# Altium project JEAC605UM-FTTSC-2.0.PRJPCB (part 3 of 3)

## Sheet POWER.schdoc
size D; SheetNumber: 8; SheetTotal: 8
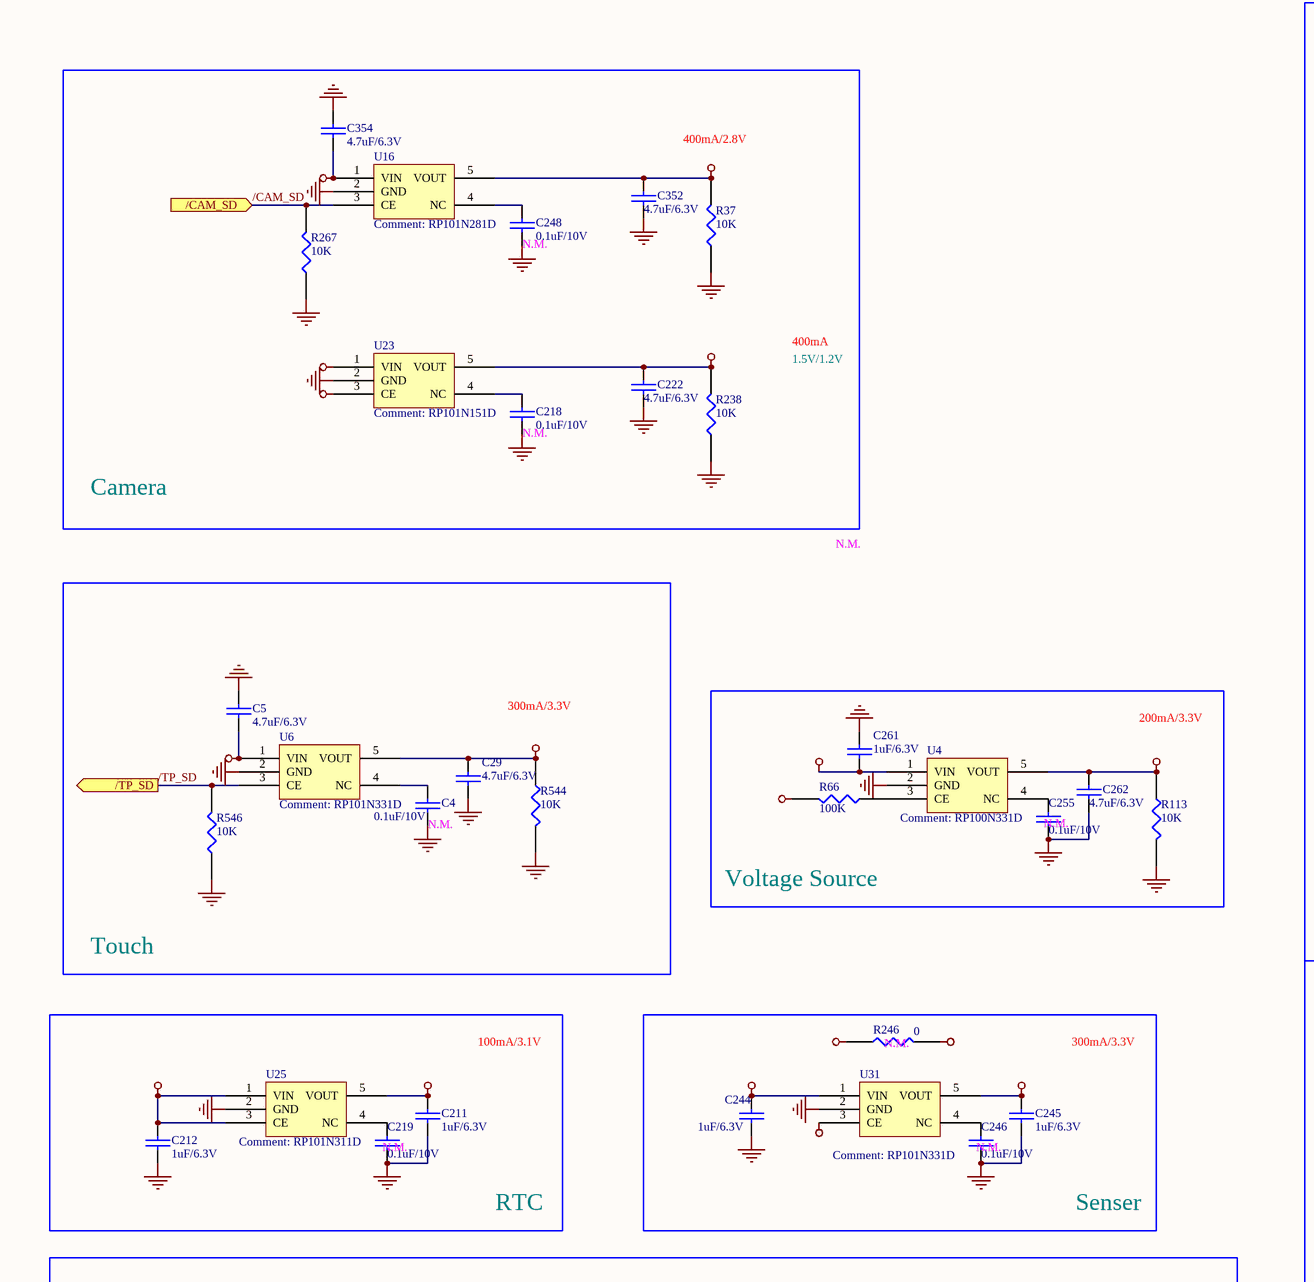
[diagram p13: POWER.schdoc, top left]
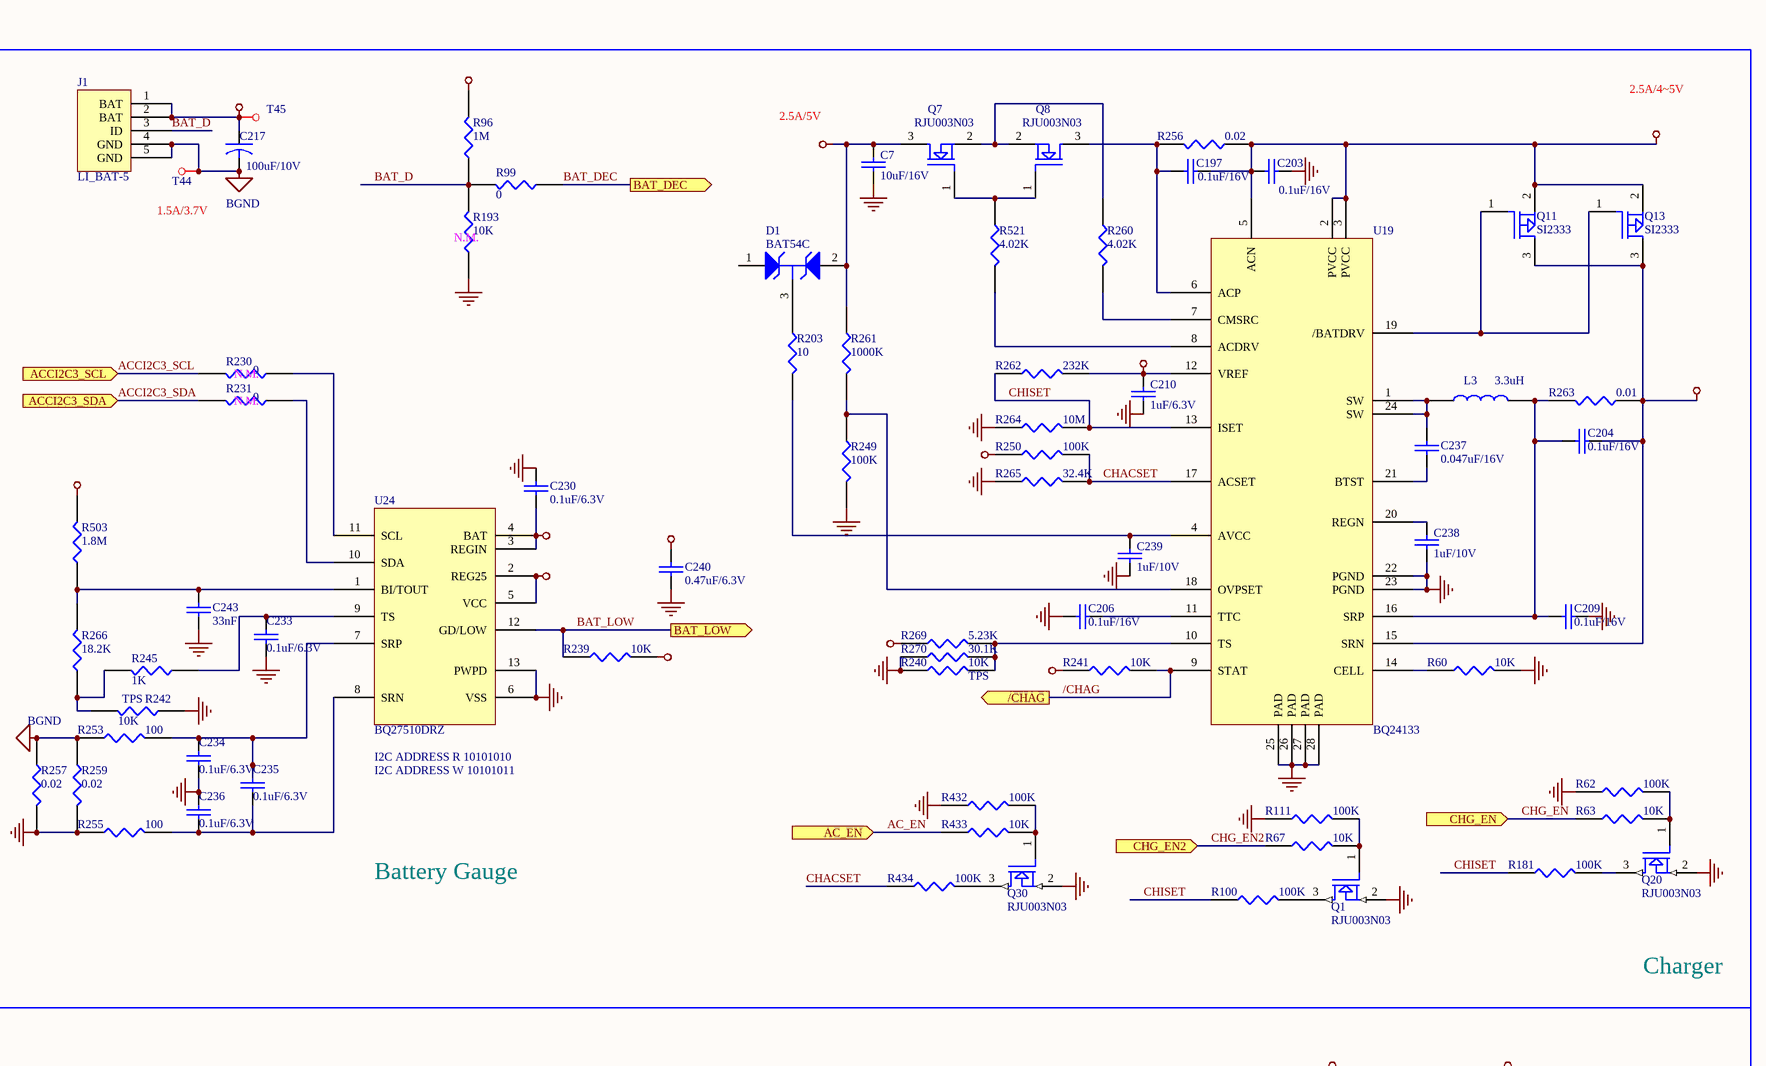
[diagram p14: POWER.schdoc, top middle]
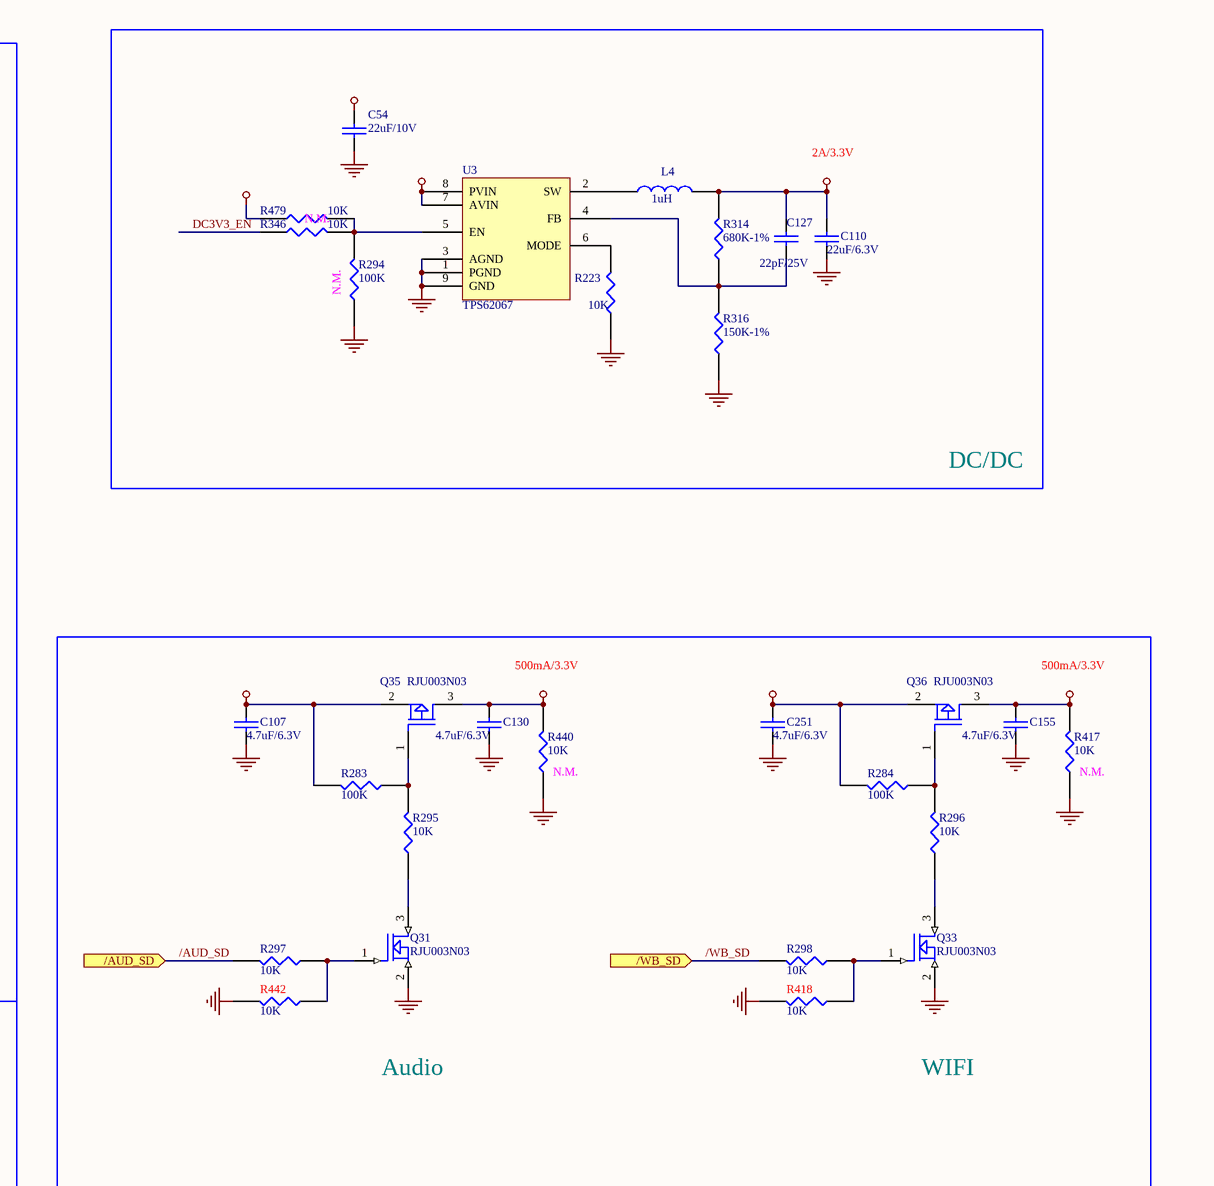
[diagram p15: POWER.schdoc, top right]
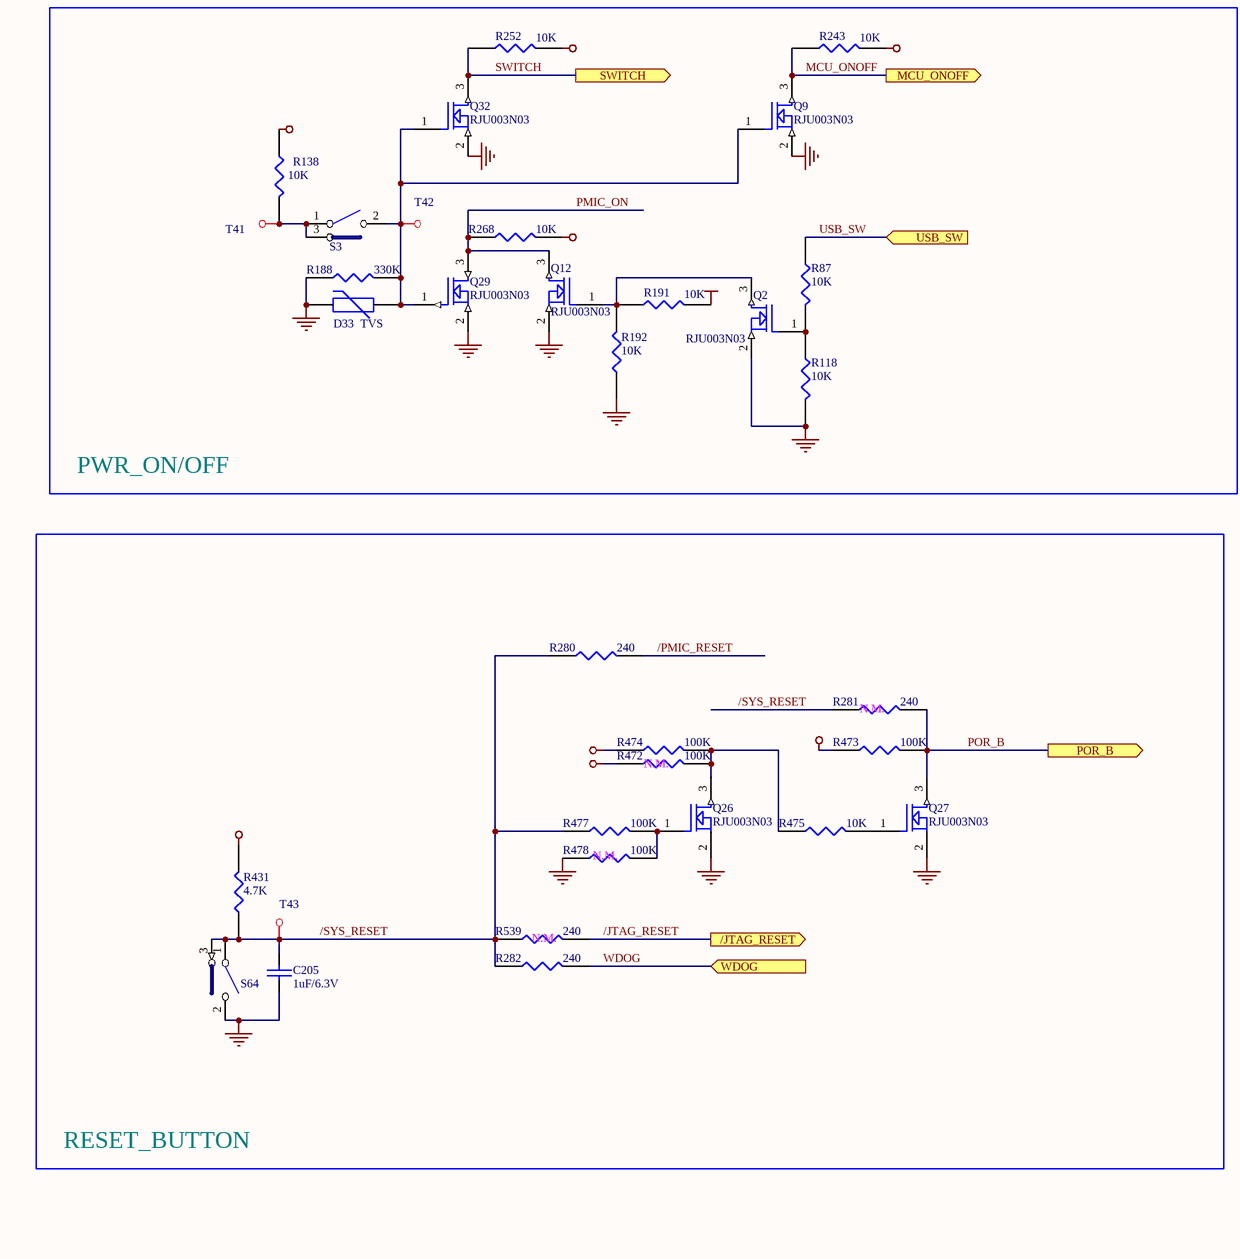
[diagram p16: POWER.schdoc, bottom left]
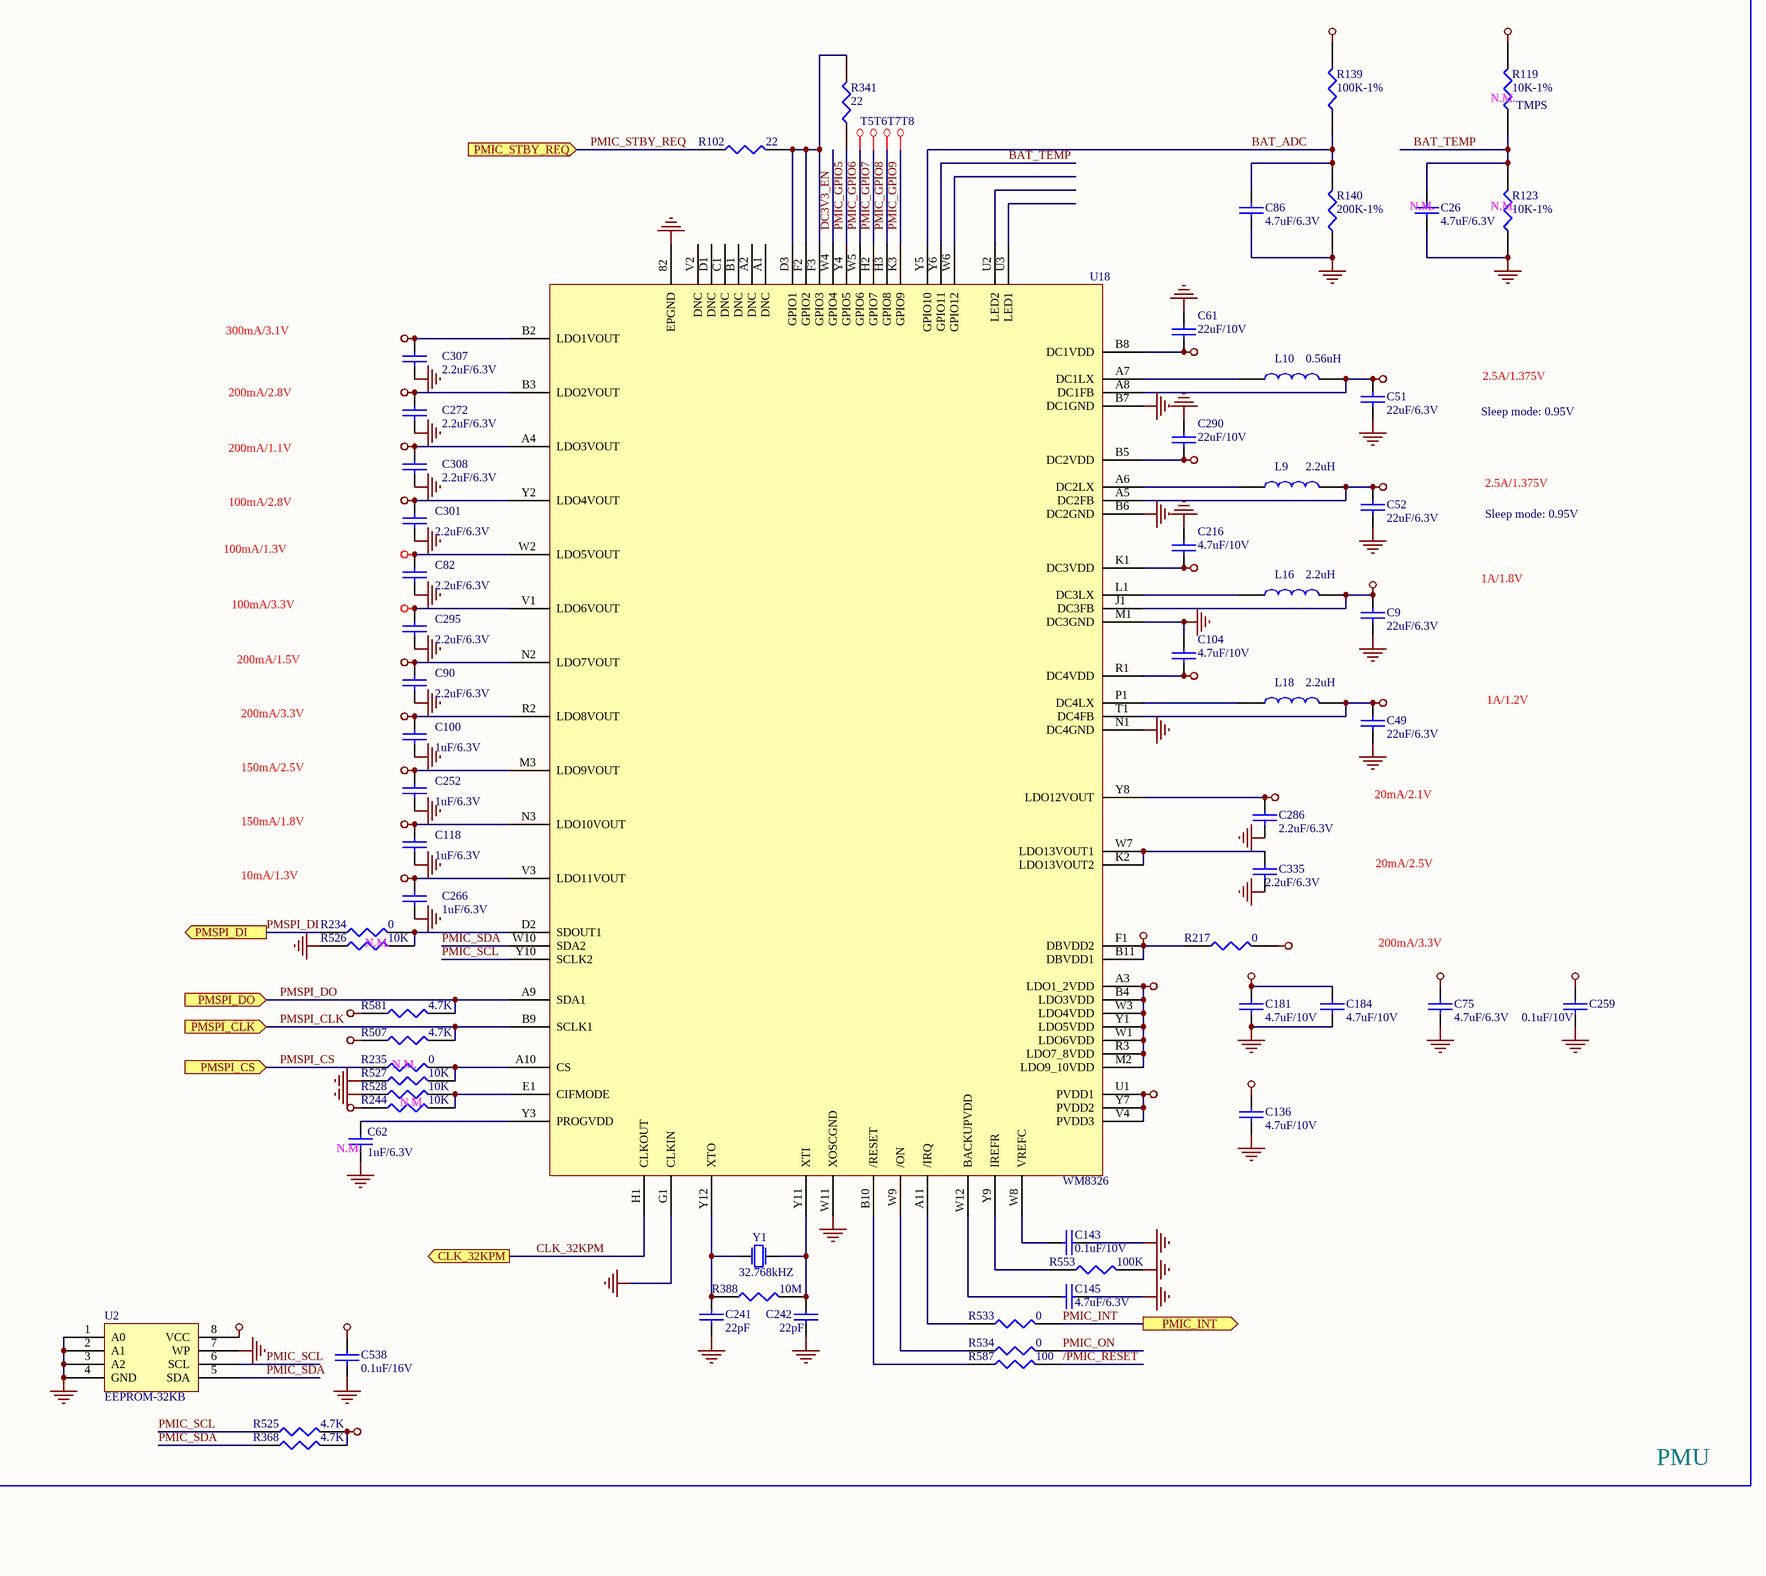
[diagram p17: POWER.schdoc, bottom middle]
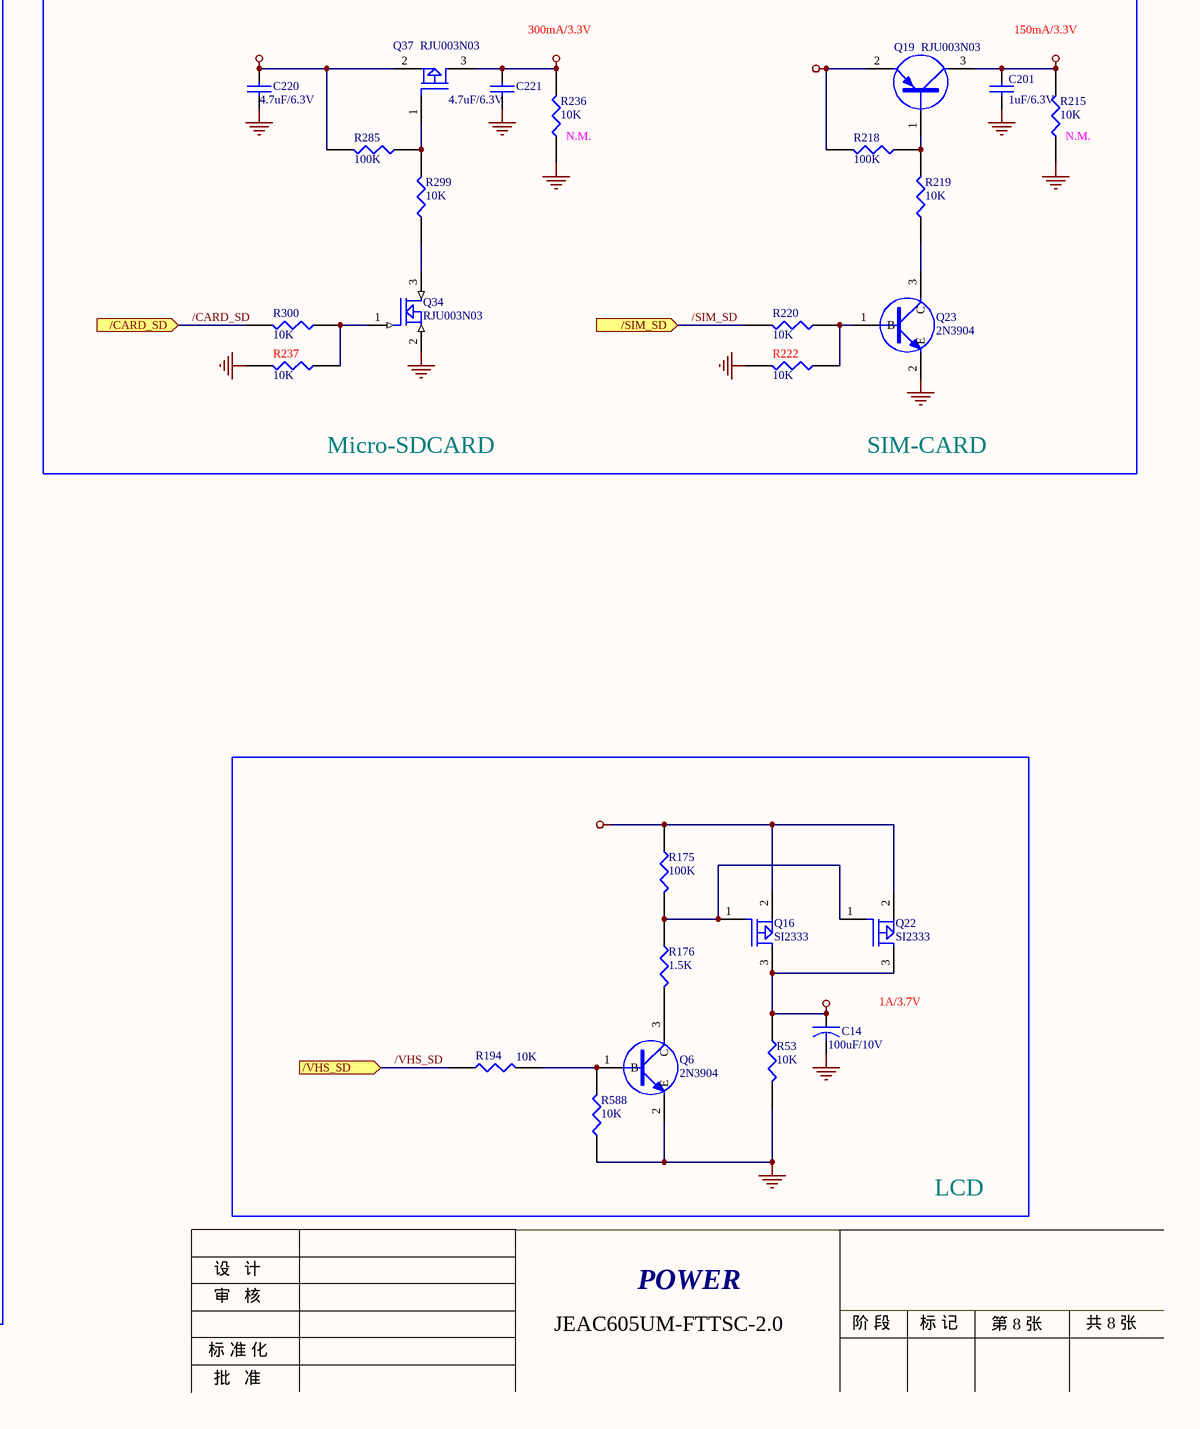
[diagram p18: POWER.schdoc, bottom right]

### Parts
C4  0.1uF/10V  [C0402]
C5  4.7uF/6.3V  [C0603]
C7  10uF/16V  [C1206]
C9  22uF/6.3V  [C0805]
C14  100uF/10V  [CASE-B]
C26  4.7uF/6.3V  [C0603]
C29  4.7uF/6.3V  [C0603]
C49  22uF/6.3V  [C0805]
C51  22uF/6.3V  [C0805]
C52  22uF/6.3V  [C0805]
C54  22uF/10V  [C0805]
C61  22uF/10V  [C0805]
C62  1uF/6.3V  [C0402]
C75  4.7uF/6.3V  [C0603]
C82  2.2uF/6.3V  [C0603]
C86  4.7uF/6.3V  [C0603]
C90  2.2uF/6.3V  [C0603]
C100  1uF/6.3V  [C0402]
C104  4.7uF/10V  [C0603]
C107  4.7uF/6.3V  [C0603]
C110  22uF/6.3V  [C0805]
C118  1uF/6.3V  [C0402]
C127  22pF/25V  [C0402]
C130  4.7uF/6.3V  [C0603]
C136  4.7uF/10V  [C0603]
C143  0.1uF/10V  [C0402]
C145  4.7uF/6.3V  [C0603]
C155  4.7uF/6.3V  [C0603]
C181  4.7uF/10V  [C0603]
C184  4.7uF/10V  [C0603]
C197  0.1uF/16V  [C0402]
C201  1uF/6.3V  [C0402]
C203  0.1uF/16V  [C0402]
C204  0.1uF/16V  [C0402]
C205  1uF/6.3V  [C0603]
C206  0.1uF/16V  [C0402]
C209  0.1uF/16V  [C0402]
C210  1uF/6.3V  [C0402]
C211  1uF/6.3V  [C0402]
C212  1uF/6.3V  [C0402]
C216  4.7uF/10V  [C0603]
C217  100uF/10V  [CASE-B]
C218  0.1uF/10V  [C0402]
C219  0.1uF/10V  [C0402]
C220  4.7uF/6.3V  [C0603]
C221  4.7uF/6.3V  [C0603]
C222  4.7uF/6.3V  [C0603]
C230  0.1uF/6.3V  [C0402]
C233  0.1uF/6.3V  [C0402]
C234  0.1uF/6.3V  [C0402]
C235  0.1uF/6.3V  [C0402]
C236  0.1uF/6.3V  [C0402]
C237  0.047uF/16V  [C0402]
C238  1uF/10V  [C0603]
C239  1uF/10V  [C0603]
C240  0.47uF/6.3V  [C0402]
C241  22pF  [C0402]
C242  22pF  [C0402]
C243  33nF  [C0402]
C244  1uF/6.3V  [C0402]
C245  1uF/6.3V  [C0402]
C246  0.1uF/10V  [C0402]
C248  0.1uF/10V  [C0402]
C251  4.7uF/6.3V  [C0603]
C252  1uF/6.3V  [C0402]
C255  0.1uF/10V  [C0402]
C259  0.1uF/10V  [C0402]
C261  1uF/6.3V  [C0402]
C262  4.7uF/6.3V  [C0603]
C266  1uF/6.3V  [C0402]
C272  2.2uF/6.3V  [C0603]
C286  2.2uF/6.3V  [C0603]
C290  22uF/10V  [C0805]
C295  2.2uF/6.3V  [C0603]
C301  2.2uF/6.3V  [C0603]
C307  2.2uF/6.3V  [C0603]
C308  2.2uF/6.3V  [C0603]
C335  2.2uF/6.3V  [C0603]
C352  4.7uF/6.3V  [C0603]
C354  4.7uF/6.3V  [C0603]
C538  0.1uF/16V  [C0402]
D1  BAT54C  [SOT-23]
D33  TVS  [D06342]
J1  LI_BAT-5  [J-BAT-5-1_25]
L3  3.3uH  [L-2-2_7]
L4  1uH  [l-2-EIA1008]
L9  2.2uH  [l-2-EIA1008]
L10  0.56uH  [l-2-EIA1008]
L16  2.2uH  [l-2-EIA1008]
L18  2.2uH  [l-2-EIA1008]
Q1  RJU003N03  [SOT-23-NPN]
Q2  RJU003N03  [SOT-23-NPN]
Q6  2N3904  [SOT-23-NPN]
Q7  RJU003N03  [SOT-23-NPN]
Q8  RJU003N03  [SOT-23-NPN]
Q9  RJU003N03  [SOT-23-NPN]
Q11  SI2333  [SOT-23]
Q12  RJU003N03  [SOT-23-NPN]
Q13  SI2333  [SOT-23]
Q16  SI2333  [SOT-23]
Q19  RJU003N03  [SOT-23-PNP]
Q20  RJU003N03  [SOT-23-NPN]
Q22  SI2333  [SOT-23]
Q23  2N3904  [SOT-23-NPN]
Q26  RJU003N03  [SOT-23-NPN]
Q27  RJU003N03  [SOT-23-NPN]
Q29  RJU003N03  [SOT-23-NPN]
Q30  RJU003N03  [SOT-23-NPN]
Q31  RJU003N03  [SOT-23-NPN]
Q32  RJU003N03  [SOT-23-NPN]
Q33  RJU003N03  [SOT-23-NPN]
Q34  RJU003N03  [SOT-23-NPN]
Q35  RJU003N03  [SOT-23]
Q36  RJU003N03  [SOT-23]
Q37  RJU003N03  [SOT-23]
R37  10K  [R0402]
R53  10K  [R0402]
R60  10K  [R0402]
R62  100K  [R0402]
R63  10K  [R0402]
R66  100K  [R0402]
R67  10K  [R0402]
R87  10K  [R0402]
R96  1M  [R0402]
R99  0  [R0402]
R100  100K  [R0402]
R102  22  [R0402]
R111  100K  [R0402]
R113  10K  [R0402]
R118  10K  [R0402]
R119  10K-1%  [R0603]
R123  10K-1%  [R0402]
R138  10K  [R0402]
R139  100K-1%  [R0402]
R140  200K-1%  [R0402]
R175  100K  [R0402]
R176  1.5K  [R0402]
R181  100K  [R0402]
R188  330K  [R0402]
R191  10K  [R0402]
R192  10K  [R0402]
R193  10K  [R0402]
R194  10K  [R0402]
R203  10  [R0402]
R215  10K  [R0402]
R217  0  [R0402]
R218  100K  [R0402]
R219  10K  [R0402]
R220  10K  [R0402]
R222  10K  [R0402]
R223  10K  [R0402]
R230  0  [R0402]
R231  0  [R0402]
R234  0  [R0402]
R235  0  [R0402]
R236  10K  [R0402]
R237  10K  [R0402]
R238  10K  [R0402]
R239  10K  [R0603]
R240  10K  [R0603]
R241  10K  [R0603]
R242  10K  [R0603]
R243  10K  [R0402]
R244  10K  [R0402]
R245  1K  [R0402]
R246  0  [R0402]
R249  100K  [R0402]
R250  100K  [R0402]
R252  10K  [R0402]
R253  100  [R0603]
R255  100  [R0603]
R256  0.02  [R0805]
R257  0.02  [R0603]
R259  0.02  [R0603]
R260  4.02K  [R0402]
R261  1000K  [R0402]
R262  232K  [R0402]
R263  0.01  [R0805]
R264  10M  [R0402]
R265  32.4K  [R0402]
R266  18.2K  [R0402]
R267  10K  [R0402]
R268  10K  [R0402]
R269  5.23K  [R0402]
R270  30.1K  [R0402]
R280  240  [R0402]
R281  240  [R0402]
R282  240  [R0402]
R283  100K  [R0402]
R284  100K  [R0402]
R285  100K  [R0402]
R294  100K  [R0402]
R295  10K  [R0402]
R296  10K  [R0402]
R297  10K  [R0402]
R298  10K  [R0402]
R299  10K  [R0402]
R300  10K  [R0402]
R314  680K-1%  [R0402]
R316  150K-1%  [R0402]
R341  22  [R0402]
R346  10K  [R0402]
R368  4.7K  [R0402]
R388  10M  [R0402]
R417  10K  [R0402]
R418  10K  [R0402]
R431  4.7K  [R0402]
R432  100K  [R0402]
R433  10K  [R0402]
R434  100K  [R0402]
R440  10K  [R0402]
R442  10K  [R0402]
R472  100K  [R0402]
R473  100K  [R0402]
R474  100K  [R0402]
R475  10K  [R0402]
R477  100K  [R0402]
R478  100K  [R0402]
R479  10K  [R0402]
R503  1.8M  [R0402]
R507  4.7K  [R0402]
R521  4.02K  [R0402]
R525  4.7K  [R0402]
R526  10K  [R0402]
R527  10K  [R0402]
R528  10K  [R0402]
R533  0  [R0402]
R534  0  [R0402]
R539  240  [R0402]
R544  10K  [R0402]
R546  10K  [R0402]
R553  100K  [R0402]
R581  4.7K  [R0402]
R587  100  [R0402]
R588  10K  [R0402]
S3  SW SPST_side  [J-SW-3-1_225]  (value not drawn)
S64  SW SPST_side  [J-SW-3-1_225]  (value not drawn)
T5  Testpoint  [TP0_5]  (value not drawn)
T6  Testpoint  [TP0_5]  (value not drawn)
T7  Testpoint  [TP0_5]  (value not drawn)
T8  Testpoint  [TP0_5]  (value not drawn)
T41  Testpoint  [TP2_0]  (value not drawn)
T42  Testpoint  [TP2_0]  (value not drawn)
T43  Testpoint  [TP2_0]  (value not drawn)
T44  Testpoint  [TP2_0]  (value not drawn)
T45  Testpoint  [TP2_0]  (value not drawn)
U2  EEPROM-32KB  [U-SO-8-1_27]
U3  TPS62067  [U-QFN-8-0_5]
U4  RP100N331D  [SOT23-5-0_95]
U6  RP101N331D  [SOT23-5-0_95]
U16  RP101N281D  [SOT23-5-0_95]
U18  WM8326  [U-WM-81-8325]
U19  BQ24133  [U-DQFN-24-0_5]
U23  RP101N151D  [SOT23-5-0_95]
U24  BQ27510DRZ  [U-SON-12-0_4]
U25  RP101N311D  [SOT23-5-0_95]
U31  RP101N331D  [SOT23-5-0_95]
Y1  32.768kHZ  [Y-2-XTALB]

### Blocks framed on the sheet
DC/DC: C54 C110 C127 L4 R223 R294 R314 R316 R346 R479 U3
Camera: C218 C222 C248 C352 C354 R37 R238 R267 U16 U23
Touch: C4 C5 C29 R544 R546 U6
Voltage Source: C255 C261 C262 R66 R113 U4
RTC: C211 C212 C219 U25
Senser: C244-C246 R246 U31
PWR_ON/OFF: D33 Q2 Q9 Q12 Q29 Q32 R87 R118 R138 R188 R191 R192 R243 R252 R268 S3 T41 T42
RESET_BUTTON: C205 Q26 Q27 R280-R282 R431 R472-R475 R477 R478 R539 S64 T43
LCD: C14 Q6 Q16 Q22 R53 R175 R176 R194 R588

### Ports
/AUD_SD (in), /CAM_SD (in), /CARD_SD (in), /CHAG (out), /JTAG_RESET (out), /SIM_SD (in), /TP_SD (out), /VHS_SD (in), /WB_SD (in), AC_EN (in), ACCI2C3_SCL (in), ACCI2C3_SDA (in), BAT_DEC (out), BAT_LOW (out), CHG_EN2 (in), CHG_EN (in), CLK_32KPM (out), MCU_ONOFF (out), PMIC_INT (out), PMIC_STBY_REQ (in), PMSPI_CLK (in), PMSPI_CS (in), PMSPI_DI (out), PMSPI_DO (in), POR_B (out), SWITCH (out), USB_SW (in), WDOG (in)

### Nets
BGND: C217.2 J1.4(GND) J1.5(GND) R253.1 R257.1 R259.1 T44.1(TP)
CHVREF: C210.1 R250.1 R262.2 R269.1 U19.12(VREF)
GND: C4.2 C5.2 C7.2 C9.2 C14.2 C26.1 C29.2 C49.2 C51.2 C52.2 C54.2 C61.1 C62.2 C75.2 C82.2 C86.1 C90.2 C100.2 C104.1 C107.2 C110.2 C118.2 C130.1 C136.2 C143.2 C145.2 C155.1 C181.2 C184.2 C201.2 C203.2 C205.1 C206.1 C209.2 C210.2 C211.2 C212.2 C216.1 C218.2 C219.2 C220.2 C221.1 C222.1 C230.2 C233.2 C234.2 C236.1 C238.2 C239.2 C240.2 C241.1 C242.1 C243.2 C244.2 C245.2 C246.2 C248.2 C251.2 C252.2 C255.2 C259.2 C261.2 C262.2 C266.2 C272.2 C286.2 C290.1 C295.2 C301.2 C307.2 C308.2 C335.1 C352.1 C354.2 C538.1 D33.2 J1.6(GND) J1.7(GND) Q1.2(S) Q2.2(S) Q6.2(E) Q9.2(S) Q12.2(S) Q20.2(S) Q23.2(E) Q26.2(S) Q27.2(S) Q29.2(S) Q30.2(S) Q31.2(S) Q32.2(S) Q33.2(S) Q34.2(S) R37.1 R53.2 R60.2 R62.1 R111.1 R113.2 R118.2 R123.1 R140.1 R188.1 R192.1 R193.1 R215.1 R222.2 R223.1 R236.1 R237.2 R238.1 R240.1 R242.1 R249.2 R255.1 R257.2 R259.2 R264.1 R265.1 R267.1 R270.1 R294.1 R316.1 R417.1 R418.2 R432.1 R440.1 R442.2 R478.1 R526.1 R527.1 R528.1 R544.2 R546.1 R553.2 R588.1 S3.6(GND) S3.7(GND) S64.2(NO) S64.6(GND) S64.7(GND) U2.1(A0) U2.2(A1) U2.3(A2) U2.4(GND) U2.7(WP) U3.1(PGND) U3.3(AGND) U3.9(GND) U4.2(GND) U6.2(GND) U16.2(GND) U18.82(EPGND) U18.B6(DC2GND) U18.B7(DC1GND) U18.G1(CLKIN) U18.M1(DC3GND) U18.N1(DC4GND) U18.W11(XOSCGND) U19.22(PGND) U19.23(PGND) U19.25(PAD) U19.26(PAD) U19.27(PAD) U19.28(PAD) U23.2(GND) U24.6(VSS) U24.13(PWPD) U25.2(GND) U31.2(GND)
LDO_1V3: C82.1 U18.W2(LDO5VOUT)
LDO_1V8: C118.1 U18.N3(LDO10VOUT)
LDO_2V5: C252.1 U18.M3(LDO9VOUT)
LDO_3V3: C295.1 U18.V1(LDO6VOUT)
LDO_RTC: C266.1 U18.V3(LDO11VOUT)
USB_BUSIN: R191.2
V_HS: C14.1 Q16.3(D) Q22.3(D) R53.1
VBUS: C7.1 D1.2(K) Q7.3(D) R261.1
VCC_1V1: C308.1 U18.A4(LDO3VOUT)
VCC_1V5: C90.1 U18.N2(LDO7VOUT)
VCC_1V8: C9.1 L16.2 U18.J1(DC3FB)
VCC_2V8: C272.1 U18.B3(LDO2VOUT)
VCC_3V: C107.1 C110.1 C127.2 C220.1 C251.1 L4.2 Q19.2(E) Q35.2(S) Q36.2(S) Q37.2(S) R66.2 R96.2 R218.2 R239.2 R241.1 R252.2 R283.2 R284.2 R285.2 R314.2 R431.2 R472.1
VCC_3V1: C307.1 R479.1 U18.B2(LDO1VOUT)
VCC_CAM: C352.2 R37.2 U16.5(VOUT) U23.1(VIN) U23.3(CE)
VCC_CAMD: C222.2 R238.2 U23.5(VOUT)
VCC_CARD: C221.2 Q37.3(D) R236.2
VCC_MEMS: C245.1 R246.2 U31.5(VOUT)
VCC_MEMS1: C100.1 R246.1 U18.R2(LDO8VOUT) U31.3(CE)
VCC_MIPIB: C301.1 U18.Y2(LDO4VOUT)
VCC_MP3: C130.2 Q35.3(D) R440.2
VCC_SIM: C201.1 Q19.3(C) R215.2
VCC_TOUCH: C29.1 R544.1 U6.5(VOUT)
VDD_ARM_IN: C52.1 L9.2 U18.A5(DC2FB)
VDD_BASIC: C259.1 C262.1 R113.1 R217.2 U4.5(VOUT)
VDD_DBVDD: C75.1 R119.2 R217.1 R507.1 R581.1 U18.B11(DBVDD1) U18.F1(DBVDD2)
VDD_REG25: C240.1 R503.2 U24.2(REG25) U24.5(VCC)
VDD_SDR_1.2V: C49.1 L18.2 U18.T1(DC4FB)
VDD_SNVS_IN: R243.2 R473.1 R474.1
VDD_SOC_IN: C51.1 L10.2 U18.A8(DC1FB)
VDD_SRTC_MX: C211.1 U25.5(VOUT)
VDD_VPMIC: C286.1 C538.2 R138.1 R268.2 R368.2 R525.2 U2.8(VCC) U18.Y8(LDO12VOUT)
VDD_WB33: C155.2 Q36.3(D) R417.2
VLI_BAT: C204.2 C217.1 C230.1 J1.1(BAT) J1.2(BAT) Q11.3(D) Q13.3(D) R139.2 R263.1 T45.1(TP) U19.15(SRN) U24.3(REGIN) U24.4(BAT)
VMAX: C5.1 C54.1 C61.2 C104.2 C136.1 C181.1 C184.1 C197.2 C203.1 C212.1 C216.2 C244.1 C261.1 C290.2 C354.1 Q11.2(S) Q13.2(S) Q16.2(S) Q22.2(S) R175.1 R244.1 R256.1 U3.7(AVIN) U3.8(PVIN) U4.1(VIN) U6.1(VIN) U16.1(VIN) U18.A3(LDO1_2VDD) U18.B4(LDO3VDD) U18.B5(DC2VDD) U18.B8(DC1VDD) U18.K1(DC3VDD) U18.M2(LDO9_10VDD) U18.R1(DC4VDD) U18.R3(LDO7_8VDD) U18.U1(PVDD1) U18.V4(PVDD3) U18.W1(LDO6VDD) U18.W3(LDO4VDD) U18.Y1(LDO5VDD) U18.Y7(PVDD2) U19.2(PVCC) U19.3(PVCC) U19.5(ACN) U25.1(VIN) U25.3(CE) U31.1(VIN)
/AUD_SD: R297.2 ; port /AUD_SD
/CAM_SD: R267.2 U16.3(CE) ; port /CAM_SD
/CARD_SD: R300.2 ; port /CARD_SD
/CHAG: R241.2 U19.9(STAT) ; port /CHAG
/JTAG_RESET: R539.2 ; port /JTAG_RESET
/PMIC_RESET: R280.2 R587.2
/SIM_SD: R220.2 ; port /SIM_SD
/SYS_RESET: C205.2 R280.1 R281.1 R282.1 R431.1 R477.1 R539.1 S64.1(COMMON) S64.3(COMMON) T43.1(TP)
/TP_SD: R546.2 U6.3(CE) ; port /TP_SD
/VHS_SD: R194.1 ; port /VHS_SD
/WB_SD: R298.2 ; port /WB_SD
AC_EN: R433.1 ; port AC_EN
ACCI2C3_SCL: R230.2 ; port ACCI2C3_SCL
ACCI2C3_SDA: R231.2 ; port ACCI2C3_SDA
BAT_ADC: C86.2 R139.1 R140.2 U18.Y5(GPIO10)
BAT_D: J1.3(ID) R96.1 R99.2 R193.2
BAT_DEC: R99.1 ; port BAT_DEC
BAT_LOW: R239.1 U24.12(GD/LOW) ; port BAT_LOW
BAT_TEMP: C26.2 R119.1 R123.2 U18.Y6(GPIO11)
CHACSET: R250.2 R265.2 R434.1 U19.17(ACSET)
CHG_EN: R63.1 ; port CHG_EN
CHG_EN2: R67.1 ; port CHG_EN2
CHISET: R100.1 R181.1 R262.1 R264.2 U19.13(ISET)
CLK_32KPM: U18.H1(CLKOUT) ; port CLK_32KPM
DC3V3_EN: R346.1 U18.W4(GPIO4)
MCU_ONOFF: Q9.3(D) R243.1 ; port MCU_ONOFF
PMIC_GPIO5: R341.1 U18.Y4(GPIO5)
PMIC_GPIO6: T5.1(TP) U18.W5(GPIO6)
PMIC_GPIO7: T6.1(TP) U18.H2(GPIO7)
PMIC_GPIO8: T7.1(TP) U18.H3(GPIO8)
PMIC_GPIO9: T8.1(TP) U18.K3(GPIO9)
PMIC_INT: R533.2 ; port PMIC_INT
PMIC_ON: Q12.3(D) Q29.3(D) R268.1 R534.2
PMIC_SCL: R525.1 U2.6(SCL) U18.Y10(SCLK2)
PMIC_SDA: R368.1 U2.5(SDA) U18.W10(SDA2)
PMIC_STBY_REQ: R102.1 ; port PMIC_STBY_REQ
PMSPI_CLK: R507.2 U18.B9(SCLK1) ; port PMSPI_CLK
PMSPI_CS: R235.1 ; port PMSPI_CS
PMSPI_DI: R234.1 ; port PMSPI_DI
PMSPI_DO: R581.2 U18.A9(SDA1) ; port PMSPI_DO
POR_B: Q27.3(D) R281.2 R473.2 ; port POR_B
SWITCH: Q32.3(D) R252.1 ; port SWITCH
USB_SW: R87.1 ; port USB_SW
WDOG: R282.2 ; port WDOG
NetC4_1: C4.1 U6.4(NC)
NetC62_1: C62.1 U18.Y3(PROGVDD)
NetC127_1: C127.1 R314.1 R316.2 U3.4(FB)
NetC143_1: C143.1 U18.W8(VREFC)
NetC145_1: C145.1 U18.W12(BACKUPVDD)
NetC197_1: C197.1 Q8.3(D) R256.2 U19.6(ACP)
NetC204_1: C204.1 C209.1 L3.2 R263.2 U19.16(SRP)
NetC206_2: C206.2 U19.11(TTC)
NetC218_1: C218.1 U23.4(NC)
NetC219_1: C219.1 U25.4(NC)
NetC233_1: C233.1 R245.1 U24.9(TS)
NetC234_1: C234.1 C235.1 R253.2 U24.7(SRP)
NetC235_2: C235.2 C236.2 R255.2 U24.8(SRN)
NetC237_1: C237.1 L3.1 U19.1(SW) U19.24(SW)
NetC237_2: C237.2 U19.21(BTST)
NetC238_1: C238.1 U19.20(REGN)
NetC239_1: C239.1 R203.2 U19.4(AVCC)
NetC241_2: C241.2 R388.1 U18.Y12(XTO) Y1.1(P1)
NetC242_2: C242.2 R388.2 U18.Y11(XTI) Y1.2(P2)
NetC243_1: C243.1 R266.2 R503.1 U24.1(BI/TOUT)
NetC246_1: C246.1 U31.4(NC)
NetC248_1: C248.1 U16.4(NC)
NetC255_1: C255.1 U4.4(NC)
NetC335_2: C335.2 U18.K2(LDO13VOUT2) U18.W7(LDO13VOUT1)
NetD1_3: D1.3(A) R203.1
NetD33_1: D33.1 Q9.1(G) Q29.1(G) Q32.1(G) R188.2 S3.2(NO) T42.1(TP)
NetL4_1: L4.1 U3.2(SW)
NetL9_1: L9.1 U18.A6(DC2LX)
NetL10_1: L10.1 U18.A7(DC1LX)
NetL16_1: L16.1 U18.L1(DC3LX)
NetL18_1: L18.1 U18.P1(DC4LX)
NetQ1_1: Q1.1(G) R67.2 R111.2
NetQ1_3: Q1.3(D) R100.2
NetQ2_1: Q2.1(G) R87.2 R118.1
NetQ2_3: Q2.3(D) Q12.1(G) R191.1 R192.2
NetQ6_1: Q6.1(B) R194.2 R588.2
NetQ6_3: Q6.3(C) R176.2
NetQ7_1: Q7.1(G) Q8.1(G) R521.1
NetQ7_2: Q7.2(S) Q8.2(S) R260.1
NetQ11_1: Q11.1(G) Q13.1(G) U19.19(/BATDRV)
NetQ16_1: Q16.1(G) Q22.1(G) R175.2 R176.1
NetQ19_1: Q19.1(B) R218.1 R219.2
NetQ20_1: Q20.1(G) R62.2 R63.2
NetQ20_3: Q20.3(D) R181.2
NetQ23_1: Q23.1(B) R220.1 R222.1
NetQ23_3: Q23.3(C) R219.1
NetQ26_1: Q26.1(G) R477.2 R478.2
NetQ26_3: Q26.3(D) R472.2 R474.2 R475.1
NetQ27_1: Q27.1(G) R475.2
NetQ30_1: Q30.1(G) R432.2 R433.2
NetQ30_3: Q30.3(D) R434.2
NetQ31_1: Q31.1(G) R297.1 R442.1
NetQ31_3: Q31.3(D) R295.1
NetQ33_1: Q33.1(G) R298.1 R418.1
NetQ33_3: Q33.3(D) R296.1
NetQ34_1: Q34.1(G) R237.1 R300.1
NetQ34_3: Q34.3(D) R299.1
NetQ35_1: Q35.1(G) R283.1 R295.2
NetQ36_1: Q36.1(G) R284.1 R296.2
NetQ37_1: Q37.1(G) R285.1 R299.2
NetR60_1: R60.1 U19.14(CELL)
NetR66_1: R66.1 U4.3(CE)
NetR102_2: R102.2 R341.2 U18.D3(GPIO1) U18.F2(GPIO2) U18.F3(GPIO3)
NetR138_2: R138.2 S3.1(COMMON) S3.3(COMMON) T41.1(TP)
NetR223_2: R223.2 U3.6(MODE)
NetR230_1: R230.1 U24.11(SCL)
NetR231_1: R231.1 U24.10(SDA)
NetR234_2: R234.2 R526.2 U18.D2(SDOUT1)
NetR235_2: R235.2 R527.2 U18.A10(CS)
NetR240_2: R240.2 R269.2 R270.2 U19.10(TS)
NetR242_2: R242.2 R245.2 R266.1
NetR244_2: R244.2 R528.2 U18.E1(CIFMODE)
NetR249_1: R249.1 R261.2 U19.18(OVPSET)
NetR260_2: R260.2 U19.7(CMSRC)
NetR294_2: R294.2 R346.2 R479.2 U3.5(EN)
NetR521_2: R521.2 U19.8(ACDRV)
NetR533_1: R533.1 U18.A11(/IRQ)
NetR534_1: R534.1 U18.W9(/ON)
NetR553_1: R553.1 U18.Y9(IREFR)
NetR587_1: R587.1 U18.B10(/RESET)

Not connected (* = marked no-connect by the designer): D1 1(A); U18 A1(DNC) A2(DNC) B1(DNC) C1(DNC) D1(DNC) U2(LED2) U3(LED1) V2(DNC) W6(GPIO12)

### Notes on the sheet
- 2.5A/4~5V
- 2.5A/5V
- 400mA/2.8V
- 1.5A/3.7V
- BGND
- 2A/3.3V
- (near R193) N.M.
- (near R479) N.M.
- (near C248) N.M.
- (near R294) N.M.
- 1.5V/1.2V
- 400mA
- (near R230) N.M.
- (near R231) N.M.
- (near C218) N.M.
- N.M.
- (near R240) TPS
- 500mA/3.3V
- 300mA/3.3V
- (near R242) TPS
- I2C ADDRESS R 10101010
- 200mA/3.3V
- I2C ADDRESS W 10101011
- (near R440) N.M.
- (near R417) N.M.
- (near C4) N.M.
- (near C255) N.M.
- Battery Gauge
- Charger
- 100mA/3.1V
- (near R246) N.M.
- Audio
- WIFI
- (near R119) N.M.
- (near R119) TMPS
- (near C219) N.M.
- (near C246) N.M.
- 150mA/3.3V
- (near C26) N.M.
- (near R123) N.M.
- 300mA/3.1V
- (near R236) N.M.
- (near R215) N.M.
- 200mA/2.8V
- 2.5A/1.375V
- 200mA/1.1V
- Sleep mode: 0.95V
- 100mA/2.8V
- 100mA/1.3V
- 100mA/3.3V
- 1A/1.8V
- 200mA/1.5V
- Micro-SDCARD
- SIM-CARD
- 1A/1.2V
- 150mA/2.5V
- 20mA/2.1V
- 150mA/1.8V
- 10mA/1.3V
- 20mA/2.5V
- (near R526) N.M.
- (near R281) N.M.
- (near R472) N.M.
- (near R235) N.M.
- (near R478) N.M.
- (near R539) N.M.
- (near C62) N.M.
- 1A/3.7V
- PMU
- 设   计
- 审   核
- POWER
- 标 准 化
- 批   准
- JEAC605UM-FTTSC-2.0
- 阶 段
- 标 记
- 第 8 张
- 共 8 张

### Library data of the parts
C4 C5 C7 C9 C29 C49 C51 C52 C54 C61 C62 C82 C90 C100 C104 C107 C110 C118 C127 C130 C143 C155 C197 C201 C203 C204 C206 C209-C212 C216 C218-C222 C230 C233-C246 C248 C251 C252 C255 C259 C261 C262 C266 C272 C286 C290 C295 C301 C307 C308 C352 C354 C538 = CAP: Capacitor
C14 C217 = CAPACITOR
C26 C75 C86 C136 C145 C181 C184 C205 C335 = CAP
D33 = SFITVS: ESD protect
L3 L4 L9 L10 L16 L18 = INDUCTOR1
Q1 Q2 Q7-Q9 Q12 Q20 Q26 Q27 Q29-Q34 = MOSFET N
Q6 Q23 = NPN: NPN Transistor
Q11 Q13 Q16 Q22 Q35-Q37 = SI1021
Q19 = PNP: PNP Transistor
R37 R53 R60 R62 R63 R66 R67 R87 R96 R99 R100 R102 R111 R113 R118 R119 R123 R138-R140 R175 R176 R181 R188 R191-R194 R203 R215 R217-R220 R222 R223 R230 R231 R234-R246 R249 R250 R252 R253 R255-R257 R259-R270 R280-R285 R294-R300 R314 R316 R341 R346 R368 R388 R417 R418 R431-R434 R440 R442 R472-R475 R477-R479 R503 R507 R521 R525-R528 R533 R534 R539 R544 R546 R553 R581 R587 R588 = RES1
U2 = MIBAO
U3 = TPS62065
U4 U6 U16 U23 U25 U31 = LDO32: LDO3.2V
U18 = WM8325
Y1 = 32.768kHZ: Crystal Oscillator

## Nets that join several sheets
DRAM_VREF: MEMORY (12 pins), CPU1 (C30.1 U22.AC2)
GND: MEMORY (111 pins), CPU1 (64 pins), CPU2 (91 pins), OTHER (64 pins), ELCD (59 pins), CPU3 (193 pins), POWER (170 pins)
USB_BUSIN: CPU2 (R315.2 R556.1 R566.1), POWER (R191.2)
V_HS: ELCD (8 pins), POWER (C14.1 Q16.3 Q22.3 R53.1)
VBUS: CPU2 (R74.1 R566.2), OTHER (J12.37 J12.38 J12.39 J12.40), POWER (C7.1 D1.2 Q7.3 R261.1)
VCC_1V1: CPU3 (R142.2), POWER (C308.1 U18.A4)
VCC_1V5: CPU3 (C87.1 C124.1 U22.G18), POWER (C90.1 U18.N2)
VCC_1V8: MEMORY (RL5.2), OTHER (6 pins), POWER (C9.1 L16.2 U18.J1)
VCC_2V8: CPU3 (R398.2), POWER (C272.1 U18.B3)
VCC_3V: MEMORY (26 pins), CPU1 (39 pins), CPU2 (C13.1 R121.1 R122.1 U27.1), OTHER (7 pins), ELCD (C192.1 Q38.2 R319.2), CPU3 (21 pins), POWER (22 pins)
VCC_3V1: CPU3 (R582.1 RL6.1), POWER (C307.1 R479.1 U18.B2)
VCC_CAM: CPU2 (10 pins), POWER (5 pins)
VCC_CAMD: CPU2 (5 pins), POWER (C222.2 R238.2 U23.5)
VCC_CARD: OTHER (J12.18), POWER (C221.2 Q37.3 R236.2)
VCC_CSI: CPU2 (R399.1), CPU3 (C43.1 R398.1 U22.N7)
VCC_MEMS: CPU2 (R56.1 R72.1 R73.1), POWER (C245.1 R246.2 U31.5)
VCC_MIPI: CPU2 (R400.1), CPU3 (C140.1 R374.1 R375.1 U22.K7)
VCC_MIPIB: CPU3 (R375.2), POWER (C301.1 U18.Y2)
VCC_MP3: OTHER (8 pins), POWER (C130.2 Q35.3 R440.2)
VCC_SIM: OTHER (J12.34), POWER (C201.1 Q19.3 R215.2)
VCC_TOUCH: CPU2 (8 pins), POWER (C29.1 R544.1 U6.5)
VDD_ARM_IN: CPU3 (13 pins), POWER (C52.1 L9.2 U18.A5)
VDD_DRAM_1.2V: MEMORY (71 pins), CPU3 (19 pins)
VDD_SDR_1.2V: MEMORY (RL10.2), POWER (C49.1 L18.2 U18.T1)
VDD_SNVS_IN: CPU1 (R7.2 R34.2 R43.2 R44.2), CPU3 (C226.1 R582.2 R583.2 U22.G11), POWER (R243.2 R473.1 R474.1)
VDD_SOC_IN: CPU3 (14 pins), POWER (C51.1 L10.2 U18.A8)
VDD_SRTC_MX: CPU3 (R583.1), POWER (C211.1 U25.5)
VDD_WB33: OTHER (18 pins), POWER (C155.2 Q36.3 R417.2)
VLI_BAT: CPU1 (R134.1), POWER (13 pins)
VMAX: CPU1 (R135.1), POWER (47 pins)
32K_OUT: CPU2 (U22.W21), OTHER (R204.1)
/AUD_SD: CPU2 (U22.F16), POWER (R297.2)
/CAM_SD: CPU2 (U22.W20), POWER (R267.2 U16.3)
/CARD_SD: CPU2 (U22.V23), POWER (R300.2)
/CHAG: CPU2 (U22.E15), POWER (R241.2 U19.9)
/EPHO_IN: CPU2 (U22.E14), OTHER (J12.17)
/JTAG_RESET: CPU1 (J9.8 R489.2), POWER (R539.2)
/SDRCAS: MEMORY (U14.G2), CPU1 (U22.AE16)
/SDRCLK0: MEMORY (C177.1 R169.2 U14.H3), CPU1 (U22.AE15)
/SDRCLK1: MEMORY (C178.1 R170.2 U15.H3), CPU1 (U22.AE14)
/SDRCS0: MEMORY (R590.2 U14.K2), CPU1 (U22.Y16)
/SDRCS1: MEMORY (U14.M3), CPU1 (U22.AD17)
/SDRDQS0: MEMORY (U14.L5), CPU1 (U22.AD3)
/SDRDQS1: MEMORY (U14.G5), CPU1 (U22.AE6)
/SDRDQS2: MEMORY (U14.P9), CPU1 (U22.AE8)
/SDRDQS3: MEMORY (U14.D9), CPU1 (U22.AB10)
/SDRDQS4: MEMORY (U15.L5), CPU1 (U22.AE18)
/SDRDQS5: MEMORY (U15.G5), CPU1 (U22.AE20)
/SDRDQS6: MEMORY (U15.P9), CPU1 (U22.AE23)
/SDRDQS7: MEMORY (U15.D9), CPU1 (U22.AA24)
/SDRRAS: MEMORY (U14.L2), CPU1 (U22.AB15)
/SDRWE: MEMORY (R148.2 U14.K1), CPU1 (U22.AB16)
/SIM_SD: CPU2 (U22.C15), POWER (R220.2)
/TP_SD: CPU2 (U22.A19), POWER (R546.2 U6.3)
/VHS_SD: CPU2 (U22.D16), POWER (R194.1)
/WB_PDN: CPU2 (U22.P6), OTHER (R212.2 U8.45)
/WB_SD: CPU2 (U22.C17), POWER (R298.2)
AC_EN: CPU2 (U22.R22), POWER (R433.1)
ACCI2C3_SCL: CPU2 (R372.2 U1.4 U22.R4), POWER (R230.2)
ACCI2C3_SDA: CPU2 (R373.2 U1.6 U22.R2), POWER (R231.2)
AUD_RST: CPU2 (U22.D15), OTHER (U28.31)
AUD_SCL: CPU2 (U22.V5), OTHER (R251.2)
AUD_SDA: CPU2 (U22.T6), OTHER (R173.2)
BAT_DEC: CPU2 (U22.C16), POWER (R99.1)
BAT_LOW: CPU2 (U22.B16), POWER (R239.1 U24.12)
BTI2S_BCLK: CPU2 (U22.U22), OTHER (U8.39)
BTI2S_DIN: CPU2 (U22.W24), OTHER (U8.38)
BTI2S_DOUT: CPU2 (U22.T20), OTHER (U8.41)
BTI2S_WCLK: CPU2 (U22.V24), OTHER (U8.40)
BTUART_CTS: CPU2 (U22.B13), OTHER (U8.29)
BTUART_RTS: CPU2 (U22.D14), OTHER (U8.31)
BTUART_RXD: CPU2 (U22.D13), OTHER (U8.27)
BTUART_TXD: CPU2 (U22.C13), OTHER (U8.26)
CHG_EN: CPU2 (U22.F15), POWER (R63.1)
CHG_EN2: CPU2 (U22.E24), POWER (R67.1)
CHRG_SD: CPU1 (R324.2 U32.5), CPU2 (U22.T24)
CLK_32KPM: OTHER (R504.1), POWER (U18.H1)
CSI0_MCLKA: CPU2 (U22.T5 U27.3), OTHER (R247.1)
EMMC_CLK: MEMORY (R58.2), CPU2 (U22.E16)
EMMC_CMD: MEMORY (R57.1 U7.W5), CPU2 (U22.B17)
EMMC_D0: MEMORY (R38.1 U7.H3), CPU2 (U22.D18)
EMMC_D1: MEMORY (R28.1 U7.H4), CPU2 (U22.B19)
EMMC_D2: MEMORY (R23.1 U7.H5), CPU2 (U22.F17)
EMMC_D3: MEMORY (R22.1 U7.J2), CPU2 (U22.A20)
EMMC_D4: MEMORY (R153.1 U7.J3), CPU2 (U22.E18)
EMMC_D5: MEMORY (R155.1 U7.J4), CPU2 (U22.C19)
EMMC_D6: MEMORY (R158.1 U7.J5), CPU2 (U22.B20)
EMMC_D7: MEMORY (R161.1 U7.J6), CPU2 (U22.D19)
EMMC_RST: MEMORY (R117.1), CPU2 (U22.A16)
FLAG_FLH: CPU1 (R337.1), CPU2 (U22.T22)
FLASH_SD: CPU1 (R325.2 U32.6), CPU2 (U22.R20)
FM_LON: CPU2 (U22.W6), OTHER (R114.1 R172.2)
FMI2C_SCL: CPU2 (U22.E25), OTHER (R272.2)
FMI2C_SDA: CPU2 (U22.J19), OTHER (R271.2)
HDI2C1_SCL: CPU2 (U22.H20), OTHER (R228.2)
HDI2C1_SDA: CPU2 (U22.G23), OTHER (R233.2)
HDMI_CECIN: CPU1 (U22.H19), CPU2 (R494.2)
HSIM_CLK: CPU2 (U22.E17), OTHER (J12.32)
HSIM_I/O: CPU2 (U22.B18), OTHER (J12.33)
HSIM_RST: CPU2 (U22.C18), OTHER (J12.31)
I2S_BCLK: CPU2 (U22.W5), OTHER (U28.7)
I2S_DIN: CPU2 (U22.U6), OTHER (U28.4)
I2S_DOUT: CPU2 (U22.V6), OTHER (U28.5)
I2S_MCLK: CPU2 (U22.A17), OTHER (R68.1)
I2S_WCLK: CPU2 (U22.U7), OTHER (U28.6)
KEYIN0: CPU2 (U22.T1), OTHER (J12.27 R308.2)
KEYIN1: CPU2 (U22.R7), OTHER (J12.28 R309.2)
KEYIN2: CPU2 (U22.R6), OTHER (J12.29 R310.2)
KEYIN3: CPU2 (U22.T3), OTHER (J12.30 R311.2)
KEYIN4: CPU2 (U22.R3), OTHER (R312.2 S62.1 S62.3 T46.1)
KEYIN5: CPU2 (U22.R5), OTHER (R313.2 S63.1 S63.3 T47.1)
LCD_HPCTL: CPU2 (U22.W23), ELCD (R201.1)
LCD_HPON: CPU2 (U22.V22), ELCD (R200.1)
LCD_PWM: CPU2 (U22.T25), ELCD (R91.1 U5.4)
LCD_RST: CPU2 (U22.U21), ELCD (R128.1)
LCD_RXCLKN: CPU1 (U22.V4), ELCD (J5.17 R227.1)
LCD_RXCLKP: CPU1 (U22.V3), ELCD (J5.18 R227.2)
LCD_RXIN0N: CPU1 (U22.U2), ELCD (J5.8 R232.1)
LCD_RXIN0P: CPU1 (U22.U1), ELCD (J5.9 R232.2)
LCD_RXIN1N: CPU1 (U22.U4), ELCD (J5.11 R229.1)
LCD_RXIN1P: CPU1 (U22.U3), ELCD (J5.12 R229.2)
LCD_RXIN2N: CPU1 (U22.V2), ELCD (J5.14 R160.1)
LCD_RXIN2P: CPU1 (U22.V1), ELCD (J5.15 R160.2)
LCD_RXIN3N: CPU1 (U22.W2), ELCD (J5.20 R97.1)
LCD_RXIN3P: CPU1 (U22.W1), ELCD (J5.21 R97.2)
LCD_STB: CPU2 (U22.V21), ELCD (R130.1)
LED_G: CPU2 (U22.U20), OTHER (J12.36)
LED_R: CPU2 (U22.W22), OTHER (J12.35)
MCU_ONOFF: CPU1 (U22.D12), POWER (Q9.3 R243.1)
MP_INT: CPU1 (U22.H24), CPU2 (Q10.2 R331.1), OTHER (J12.12)
PMIC_INT: CPU2 (U22.A15), POWER (R533.2)
PMIC_STBY_REQ: CPU1 (U22.F11), POWER (R102.1)
PMSPI_CLK: CPU2 (U22.U23), POWER (R507.2 U18.B9)
PMSPI_CS: CPU2 (U22.V25), POWER (R235.1)
PMSPI_DI: CPU2 (U22.U24), POWER (R234.1)
PMSPI_DO: CPU2 (U22.T21), POWER (R581.2 U18.A9)
POR_B: CPU1 (U22.C11), POWER (Q27.3 R281.2 R473.2)
SD1_CD: CPU2 (U22.V20), OTHER (J12.25)
SD1_CLK: CPU2 (U22.D20), OTHER (R59.2)
SD1_CMD: CPU2 (U22.B21), OTHER (R65.2)
SD1_D0: CPU2 (U22.A21), OTHER (R39.2)
SD1_D1: CPU2 (U22.C20), OTHER (R41.2)
SD1_D2: CPU2 (U22.E19), OTHER (R46.2)
SD1_D3: CPU2 (U22.F18), OTHER (R47.2)
SD2_CLK: CPU2 (U22.C21), OTHER (R224.1)
SD2_CMD: CPU2 (U22.F19), OTHER (R293.2 U8.11)
SD2_D0: CPU2 (U22.A22), OTHER (R289.2 U8.10)
SD2_D1: CPU2 (U22.E20), OTHER (R290.2 U8.9)
SD2_D2: CPU2 (U22.A23), OTHER (R291.2 U8.7)
SD2_D3: CPU2 (U22.B22), OTHER (R292.2 U8.8)
SDRA0: MEMORY (U14.E2), CPU1 (U22.AC14)
SDRA1: MEMORY (U14.F3), CPU1 (U22.AB14)
SDRA2: MEMORY (U14.E3), CPU1 (U22.AA14)
SDRA3: MEMORY (U15.N3), CPU1 (U22.Y14)
SDRA4: MEMORY (U15.P3), CPU1 (U22.W14)
SDRA5: MEMORY (U15.M2), CPU1 (U22.AE13)
SDRA6: MEMORY (U15.M3), CPU1 (U22.AC13)
SDRA7: MEMORY (R149.2 U15.K1), CPU1 (U22.Y13)
SDRA8: MEMORY (U15.M1), CPU1 (U22.AB13)
SDRA9: MEMORY (R589.2 U15.K2), CPU1 (U22.AE12)
SDRA10: MEMORY (U14.F2), CPU1 (U22.AA15)
SDRA11: MEMORY (U15.L2), CPU1 (U22.AC12)
SDRA12: MEMORY (U15.L1), CPU1 (U22.AD12)
SDRA13: MEMORY (U14.N3), CPU1 (U22.AC17)
SDRA14: MEMORY (U15.G2), CPU1 (U22.AA12)
SDRA15: MEMORY (U15.F3), CPU1 (U22.Y12)
SDRBA0: MEMORY (U14.L1), CPU1 (U22.AC15)
SDRBA1: MEMORY (U14.M1), CPU1 (U22.Y15)
SDRBA2: MEMORY (U15.F2), CPU1 (U22.AB12)
SDRCKE0: MEMORY (U15.E2), CPU1 (U22.Y11)
SDRCKE1: MEMORY (U15.E3), CPU1 (U22.AA11)
SDRCLK0: MEMORY (C177.2 R169.1 U14.J3), CPU1 (U22.AD15)
SDRCLK1: MEMORY (C178.2 R170.1 U15.J3), CPU1 (U22.AD14)
SDRD0: MEMORY (U14.N8), CPU1 (U22.AD2)
SDRD1: MEMORY (U14.M9), CPU1 (U22.AE2)
SDRD2: MEMORY (U14.M8), CPU1 (U22.AC4)
SDRD3: MEMORY (U14.L7), CPU1 (U22.AA5)
SDRD4: MEMORY (U14.L9), CPU1 (U22.AC1)
SDRD5: MEMORY (U14.M7), CPU1 (U22.AD1)
SDRD6: MEMORY (U14.L8), CPU1 (U22.AB4)
SDRD7: MEMORY (U14.M6), CPU1 (U22.AE4)
SDRD8: MEMORY (U14.G9), CPU1 (U22.AD5)
SDRD9: MEMORY (U14.F6), CPU1 (U22.AE5)
SDRD10: MEMORY (U14.E8), CPU1 (U22.AA6)
SDRD11: MEMORY (U14.G7), CPU1 (U22.AE7)
SDRD12: MEMORY (U14.F9), CPU1 (U22.AB5)
SDRD13: MEMORY (U14.F8), CPU1 (U22.AC5)
SDRD14: MEMORY (U14.F7), CPU1 (U22.AB6)
SDRD15: MEMORY (U14.G8), CPU1 (U22.AC7)
SDRD16: MEMORY (U14.T7), CPU1 (U22.AB7)
SDRD17: MEMORY (U14.R8), CPU1 (U22.AA8)
SDRD18: MEMORY (U14.P6), CPU1 (U22.AB9)
SDRD19: MEMORY (U14.N5), CPU1 (U22.Y9)
SDRD20: MEMORY (U14.T8), CPU1 (U22.Y7)
SDRD21: MEMORY (U14.P7), CPU1 (U22.Y8)
SDRD22: MEMORY (U14.T9), CPU1 (U22.AC8)
SDRD23: MEMORY (U14.N6), CPU1 (U22.AA9)
SDRD24: MEMORY (U14.E6), CPU1 (U22.AE9)
SDRD25: MEMORY (U14.B7), CPU1 (U22.Y10)
SDRD26: MEMORY (U14.D7), CPU1 (U22.AE11)
SDRD27: MEMORY (U14.B8), CPU1 (U22.AB11)
SDRD28: MEMORY (U14.D6), CPU1 (U22.AC9)
SDRD29: MEMORY (U14.E5), CPU1 (U22.AD9)
SDRD30: MEMORY (U14.C8), CPU1 (U22.AD11)
SDRD31: MEMORY (U14.B9), CPU1 (U22.AC11)
SDRD32: MEMORY (U15.N8), CPU1 (U22.AA17)
SDRD33: MEMORY (U15.M7), CPU1 (U22.AA18)
SDRD34: MEMORY (U15.M9), CPU1 (U22.AC18)
SDRD35: MEMORY (U15.L7), CPU1 (U22.AE19)
SDRD36: MEMORY (U15.M8), CPU1 (U22.Y17)
SDRD37: MEMORY (U15.M6), CPU1 (U22.Y18)
SDRD38: MEMORY (U15.L9), CPU1 (U22.AB19)
SDRD39: MEMORY (U15.L8), CPU1 (U22.AC19)
SDRD40: MEMORY (U15.G9), CPU1 (U22.Y19)
SDRD41: MEMORY (U15.G8), CPU1 (U22.AB20)
SDRD42: MEMORY (U15.F7), CPU1 (U22.AB21)
SDRD43: MEMORY (U15.F8), CPU1 (U22.AD21)
SDRD44: MEMORY (U15.F9), CPU1 (U22.Y20)
SDRD45: MEMORY (U15.E8), CPU1 (U22.AA20)
SDRD46: MEMORY (U15.G7), CPU1 (U22.AE21)
SDRD47: MEMORY (U15.F6), CPU1 (U22.AC21)
SDRD48: MEMORY (U15.T7), CPU1 (U22.AC22)
SDRD49: MEMORY (U15.P7), CPU1 (U22.AE22)
SDRD50: MEMORY (U15.T9), CPU1 (U22.AE24)
SDRD51: MEMORY (U15.R8), CPU1 (U22.AC24)
SDRD52: MEMORY (U15.N5), CPU1 (U22.AB22)
SDRD53: MEMORY (U15.N6), CPU1 (U22.AC23)
SDRD54: MEMORY (U15.P6), CPU1 (U22.AD25)
SDRD55: MEMORY (U15.T8), CPU1 (U22.AC25)
SDRD56: MEMORY (U15.E6), CPU1 (U22.AB25)
SDRD57: MEMORY (U15.B7), CPU1 (U22.AA21)
SDRD58: MEMORY (U15.E5), CPU1 (U22.Y25)
SDRD59: MEMORY (U15.C8), CPU1 (U22.Y22)
SDRD60: MEMORY (U15.B8), CPU1 (U22.AB23)
SDRD61: MEMORY (U15.B9), CPU1 (U22.AA23)
SDRD62: MEMORY (U15.D7), CPU1 (U22.Y23)
SDRD63: MEMORY (U15.D6), CPU1 (U22.W25)
SDRDM0: MEMORY (U14.K5), CPU1 (U22.AC3)
SDRDM1: MEMORY (U14.H5), CPU1 (U22.AC6)
SDRDM2: MEMORY (U14.N7), CPU1 (U22.AB8)
SDRDM3: MEMORY (U14.E7), CPU1 (U22.AE10)
SDRDM4: MEMORY (U15.K5), CPU1 (U22.AB18)
SDRDM5: MEMORY (U15.H5), CPU1 (U22.AC20)
SDRDM6: MEMORY (U15.N7), CPU1 (U22.AD24)
SDRDM7: MEMORY (U15.E7), CPU1 (U22.Y21)
SDRDQS0: MEMORY (U14.L6), CPU1 (U22.AE3)
SDRDQS1: MEMORY (U14.G6), CPU1 (U22.AD6)
SDRDQS2: MEMORY (U14.P8), CPU1 (U22.AD8)
SDRDQS3: MEMORY (U14.D8), CPU1 (U22.AC10)
SDRDQS4: MEMORY (U15.L6), CPU1 (U22.AD18)
SDRDQS5: MEMORY (U15.G6), CPU1 (U22.AD20)
SDRDQS6: MEMORY (U15.P8), CPU1 (U22.AD23)
SDRDQS7: MEMORY (U15.D8), CPU1 (U22.AA25)
SDRDT0: MEMORY (U14.M2), CPU1 (U22.AC16)
SDRDT1: MEMORY (U14.P3), CPU1 (U22.AB17)
SWITCH: CPU2 (U22.W4), POWER (Q32.3 R252.1)
TORCH_SD: CPU1 (R327.2 U32.7), CPU2 (U22.U25)
UBSPI_CLK: MEMORY (U10.6), CPU2 (U22.C25)
UBSPI_CS: MEMORY (U10.1), CPU2 (U22.G21)
UBSPI_DI: MEMORY (U10.2), CPU2 (U22.F21)
UBSPI_DO: MEMORY (U10.5), CPU2 (U22.D24)
UBSPI_WP: MEMORY (R254.1), CPU2 (U22.G20)
UOTG_DN: CPU2 (U22.B6), OTHER (U11.3)
UOTG_DP: CPU2 (U22.A6), OTHER (U11.2)
USB_SW: CPU2 (U22.B15), POWER (R87.1)
WAN_WK: CPU2 (U22.J20), OTHER (R178.1)
WB_RST: CPU2 (U22.P5), OTHER (R210.1 U8.43)
WDOG: CPU2 (U22.T2), POWER (R282.2)
WLBT_WK: CPU2 (U22.H21), OTHER (R174.1)